# Altium schematic sheet Environmental Sensor.SchDoc: Environmental Sensor
size A4; SheetNumber: 3; SheetTotal: 7
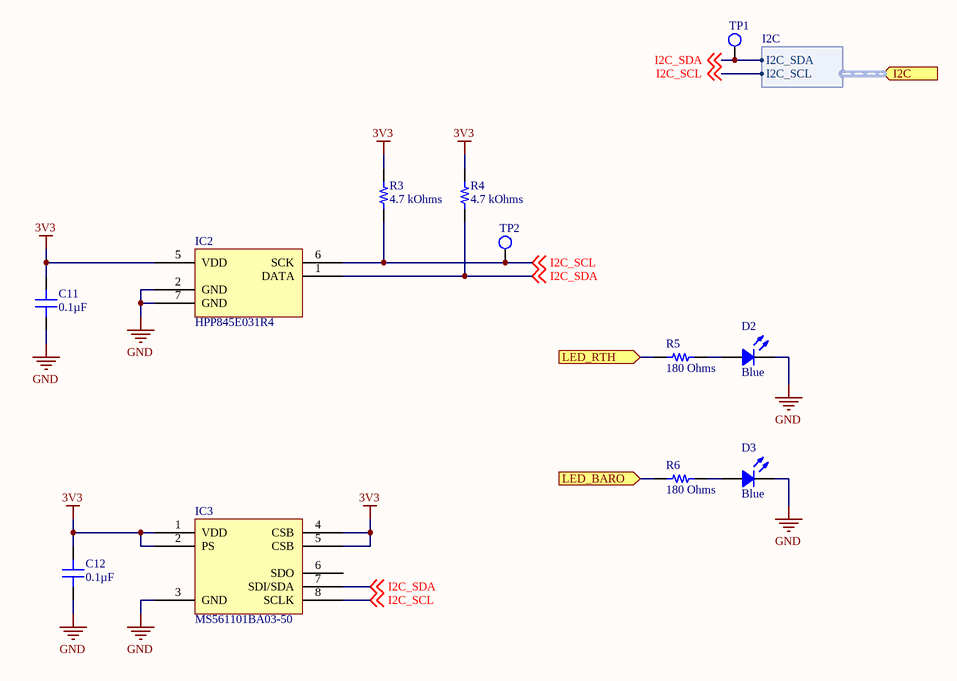
[diagram p0: Environmental Sensor.SchDoc]

## Parts
C11  0.1µF  [CAP 0603_1608]
C12  0.1µF  [CAP 0603_1608]
D2  Blue  [LED 1206_3216 BLUE]
D3  Blue  [LED 1206_3216 BLUE]
IC2  HPP845E031R4  [TE HPP845E031R4]
IC3  MS561101BA03-50  [MEAS SPEC MS5611-01BA03]
R3  4.7 kOhms  [RES 0603_1608]
R4  4.7 kOhms  [RES 0603_1608]
R5  180 Ohms  [RES 0603_1608]
R6  180 Ohms  [RES 0603_1608]
TP1  Test Point  [TestPoint-1.5mm]  (value not drawn)  (no BOM)
TP2  Test Point  [TestPoint-1.5mm]  (value not drawn)  (no BOM)

## Ports
I2C (in, harness I2C), LED_BARO (in), LED_RTH (in)

## Harnesses
I2C: I2C_SDA, I2C_SCL

## Nets
3V3: C11.2 C12.2 IC2.5(VDD) IC3.1(VDD) IC3.2(PS) IC3.4(CSB) IC3.5(CSB) R3.2 R4.2
GND: C11.1 C12.1 D2.2 D3.2 IC2.2(GND) IC2.7(GND) IC3.3(GND)
I2C_SCL: IC2.6(SCK) IC3.8(SCLK) R3.1 TP2.1(TP) ; off-sheet I2C_SCL, port I2C.I2C_SCL
I2C_SDA: IC2.1(DATA) IC3.7(SDI/SDA) R4.1 TP1.1(TP) ; off-sheet I2C_SDA, port I2C.I2C_SDA
LED_BARO: R6.1 ; port LED_BARO
LED_RTH: R5.1 ; port LED_RTH
NetD2_1: D2.1 R5.2
NetD3_1: D3.1 R6.2

Not connected (* = marked no-connect by the designer): IC3 6(SDO)

## Notes on the sheet
- Title
- Size:
- Date:
- A4
- Number:
- Time:
- Revision:
- Sheet
- of
- File:

## Library data of the parts
C11 C12 = 06035C104JAT4A: CAP CER 0.1UF 50V X7R 0603; Manufacturer: AVX Corporation; Tolerance: ±5%; Part Number: 06035C104JAT4A; Value: 0.1µF; Applications: General Purpose; Capacitance: 0.1µF; ComponentLink1Description: Datasheet; ComponentLink1URL: http://datasheets.avx.com/X7RDielectric.pdf; ComponentLink2Description: DigiKey Link; ComponentLink2URL: http://digikey.com/product-detail/en/avx-corporation/06035C104JAT4A/478-12459-1-ND/9749311; Device Package: 0603 (1608 Metric); LastUpdated: 02/09/2020 01:03:34; Lifecycle Status: Active; Minimum Order: 1; Mounting Type: Surface Mount, MLCC; Operating Temperature: -55°C ~ 125°C; Package / Case: 0603 (1608 Metric); Packaging: TapeAndReel; PartId: 3002; Part Status: Active; Price: 0.01; Series: -; Size / Dimension: 0.063" L x 0.032" W (1.60mm x 0.81mm); Supplier 1: DigiKey; Supplier Part Number 1: 478-12459-1-ND; Temperature Coefficient: X7R; Thickness (Max): 0.035" (0.90mm); Voltage - Rated: 50V
D2 D3 = BL-HB333Q-AV-TRB: 1206 0.5MM BLUE WATER CLEAR SMT; Manufacturer: American Bright Optoelectronics Corporation; Configuration: Standard; Current - Test: 5mA; Lens Color: Colorless; Lens Size: 2.00mm x 1.50mm; Lens Style: Rectangle with Flat Top; Millicandela Rating: 15mcd; Viewing Angle: 120°; Voltage - Forward (Vf) (Typ): 2.8V; Wavelength - Peak: 460nm; Part Number: BL-HB333Q-AV-TRB; Color: Blue; ComponentLink1Description: Datasheet; ComponentLink1URL: //media.digikey.com/pdf/Data%20Sheets/American%20Bright%20Opto%20PDFs/BL-HB333Q-AV-TRB_V1.0_9-29-09.pdf; ComponentLink2Description: DigiKey Link; ComponentLink2URL: http://digikey.com/product-detail/en/american-bright-optoelectronics-corporation/BL-HB333Q-AV-TRB/2007-BL-HB333Q-AV-TRBCT-ND/9924239; Device Package: 1206 (3216 Metric); Height (Max): 0.55mm; LastUpdated: 02/09/2020 01:20:33; Lens Transparency: Clear; Lifecycle Status: Active; Minimum Order: 1; Mounting Type: Surface Mount; Package / Case: 1206 (3216 Metric); Packaging: TapeAndReel; PartId: 746; Part Status: Active; Price: 0.09; Series: -; Size / Dimension: 3.20mm L x 1.60mm W; Supplier 1: DigiKey; Supplier Part Number 1: 2007-BL-HB333Q-AV-TRBCT-ND; Supplier Device Package: 1206; Value: Blue
IC2 = HPP845E031R4: SENSOR HUMID/TEMP 3V I2C 2% SMD; Manufacturer: TE Connectivity Measurement Specialties; Accuracy: ±2% RH; Humidity Range: 0 ~ 100% RH; Output: 12b; Output Type: I²C; Response Time: 5s; Sensor Type: Humidity, Temperature; Voltage - Supply: 1.5V ~ 3.6V; Part Number: HPP845E031R4; ComponentLink1Description: Datasheet; ComponentLink1URL: https://www.te.com/commerce/DocumentDelivery/DDEController?Action=srchrtrv&DocNm=HPC199_6&DocType=Data+Sheet&DocLang=English; ComponentLink2Description: DigiKey Link; ComponentLink2URL: http://digikey.com/product-detail/en/te-connectivity-measurement-specialties/HPP845E031R4/223-1144-1-ND/3945773; Device Package: 6-VDFN Exposed Pad; LastUpdated: 24/05/2020 22:55:13; Lifecycle Status: Active; Minimum Order: 1; Mounting Type: Surface Mount; Operating Temperature: -40°C ~ 125°C; Package / Case: 6-VDFN Exposed Pad; Packaging: TapeAndReel; Part Status: Active; Price: 2.87; Series: HTU; Supplier 1: DigiKey; Supplier Part Number 1: 223-1144-1-ND; Supplier Device Package: 6-DFN (3x3)
IC3 = MS561101BA03-50: BAROMETRIC PRESSURE SENSOR; Manufacturer: TE Connectivity Measurement Specialties; Accuracy: ±0.022PSI (±0.15kPa); Maximum Pressure: 87.02PSI (600kPa); Operating Pressure: 0.15PSI ~ 17.4PSI (1kPa ~ 120kPa); Output: 24 b; Output Type: I²C, SPI; Port Style: No Port; Pressure Type: Absolute; Voltage - Supply: 1.8V ~ 3.6V; Part Number: MS561101BA03-50; Applications: Board Mount; ComponentLink1Description: Datasheet; ComponentLink1URL: https://www.te.com/commerce/DocumentDelivery/DDEController?Action=srchrtrv&DocNm=MS5611-01BA03&DocType=Data+Sheet&DocLang=English; ComponentLink2Description: DigiKey Link; ComponentLink2URL: http://digikey.com/product-detail/en/te-connectivity-measurement-specialties/MS561101BA03-50/223-1622-1-ND/5277638; Device Package: 8-SMD; LastUpdated: 20/04/2020 15:54:53; Lifecycle Status: Active; Minimum Order: 1; Operating Temperature: -40°C ~ 85°C; Package / Case: 8-SMD; Packaging: Unknown; Part Status: Active; Price: 6.37; Series: -; Supplier 1: DigiKey; Supplier Part Number 1: 223-1622-1-ND; Termination Style: SMD (SMT) Tab
R3 R4 = ERJ-3EKF4701V: RES SMD 4.7K OHM 1% 1/10W 0603; Manufacturer: Panasonic Electronic Components; Power (Watts): 0.1W, 1/10W; Temperature Coefficient: ±100ppm/°C; Part Number: ERJ-3EKF4701V; Value: 4.7 kOhms; ComponentLink1Description: Datasheet; ComponentLink1URL: https://industrial.panasonic.com/cdbs/www-data/pdf/RDA0000/AOA0000C304.pdf; ComponentLink2Description: DigiKey Link; ComponentLink2URL: http://digikey.com/product-detail/en/panasonic-electronic-components/ERJ-3EKF4701V/P4.70KHCT-ND/1746782; Composition: Thick Film; Device Package: 0603 (1608 Metric); Features: Automotive AEC-Q200; Height - Seated (Max): 0.022" (0.55mm); LastUpdated: 02/09/2020 01:10:23; Lifecycle Status: Active; Minimum Order: 1; Number of Terminations: 2; Operating Temperature: -55°C ~ 155°C; Package / Case: 0603 (1608 Metric); Packaging: TapeAndReel; PartId: 5645; Part Status: Active; Price: 0.01; Ratings: AEC-Q200; Resistance: 4.7 kOhms; Series: ERJ; Size / Dimension: 0.063" L x 0.031" W (1.60mm x 0.80mm); Supplier 1: DigiKey; Supplier Part Number 1: P4.70KHCT-ND; Supplier Device Package: 0603; Tolerance: ±1%
R5 R6 = ERJ-PA3J181V: RES SMD 180 OHM 5% 1/4W 0603; Manufacturer: Panasonic Electronic Components; Power (Watts): 0.25W, 1/4W; Temperature Coefficient: ±200ppm/°C; Part Number: ERJ-PA3J181V; Value: 180 Ohms; ComponentLink1Description: Datasheet; ComponentLink1URL: https://industrial.panasonic.com/cdbs/www-data/pdf/RDO0000/AOA0000C331.pdf; ComponentLink2Description: DigiKey Link; ComponentLink2URL: http://digikey.com/product-detail/en/panasonic-electronic-components/ERJ-PA3J181V/P180BZCT-ND/5036266; Composition: Thick Film; Device Package: 0603 (1608 Metric); Features: Automotive AEC-Q200, Pulse Withstanding; Height - Seated (Max): 0.022" (0.55mm); LastUpdated: 02/09/2020 01:09:49; Lifecycle Status: Active; Minimum Order: 1; Number of Terminations: 2; Operating Temperature: -55°C ~ 155°C; Package / Case: 0603 (1608 Metric); Packaging: TapeAndReel; PartId: 21551; Part Status: Active; Price: 0.01; Ratings: AEC-Q200; Resistance: 180 Ohms; Series: ERJ; Size / Dimension: 0.063" L x 0.031" W (1.60mm x 0.80mm); Supplier 1: DigiKey; Supplier Part Number 1: P180BZCT-ND; Supplier Device Package: 0603; Tolerance: ±5%